# Altium schematic sheet Sheet1.SchDoc
size 420 x 297 mm; SheetTotal: 1
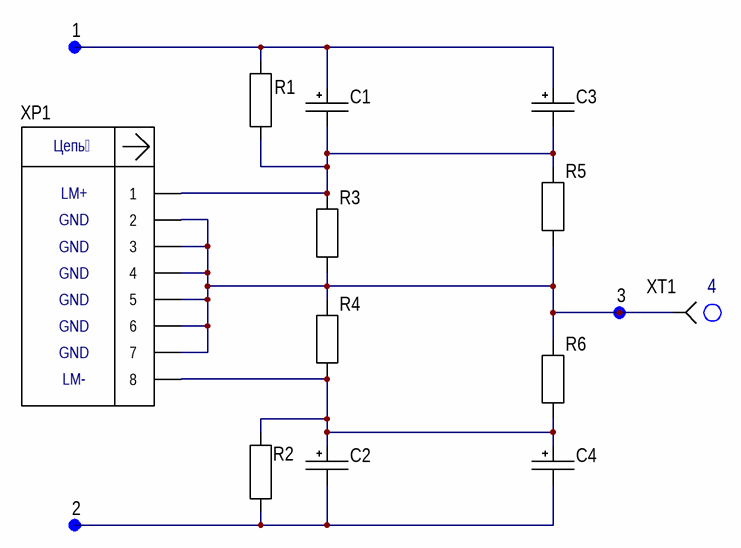
[diagram p0: Sheet1.SchDoc]

## Parts
1  OTV  (value not drawn)
2  OTV  (value not drawn)
3  OTV  (value not drawn)
C1  B43640A2228M000  [B43640A2228M000]  (value not drawn)
C2  B43640A2228M000  [B43640A2228M000]  (value not drawn)
C3  B43640A2228M000  [B43640A2228M000]  (value not drawn)
C4  B43640A2228M000  [B43640A2228M000]  (value not drawn)
R1  С2-33Н-0,5-24 кОм +-5%  [С2-33Н-0,5АИ (070.04.0601.14.00)]  (value not drawn)
R2  С2-33Н-0,5-24 кОм +-5%  [С2-33Н-0,5АИ (070.04.0601.14.00)]  (value not drawn)
R3  OAR3-R005FI  [OAR3]  (value not drawn)
R4  OAR3-R005FI  [OAR3]  (value not drawn)
R5  OAR3-R005FI  [OAR3]  (value not drawn)
R6  OAR3-R005FI  [OAR3]  (value not drawn)
XP1  280373-2  [280373-2]  (value not drawn)
XT1  SOCKET  (value not drawn)

## Nets
Net1_?1: 1.?1 C1.1 C3.1 R1.2
Net2_?1: 2.?1 C2.2 C4.2 R2.1
Net3_?1: 3.?1 R3.1 R4.2 R5.1 R6.2 XP1.2 XP1.3 XP1.4 XP1.5 XP1.6 XP1.7
NetC1_2: C1.2 C3.2 R1.1 R3.2 R5.2 XP1.1
NetC2_1: C2.1 C4.1 R2.2 R4.1 R6.1 XP1.8

## Notes on the sheet
- LM+
- GND
- (near XT1) 4
- LM-
- Перв. примен.
- Справ. №
- Подп. дата
- Инв. № дубл.
- Взам. инв. №
- Подп. и дата
- Изм.
- Разраб.
- Лист
- № докум.
- Подп.
- Дата
- Лит.
- Масса
- Масштаб
- Пров.
- Т.контр.
- Листов
- Инв. № подл.
- Н.контр.
- Утв.
- ALTIUM GOSTBOM2.0 KEV
- Формат А3
- (in symbol 280373-2) Цепь

## Library data of the parts
C1-C4 = B43640A2228M000: Capacitor Polarised, 2200uF, 30x55
R1 R2 = С2-33Н-0,5-24 кОм +-5%: Резисторы постоянные непроволочные общего применения С2-33Н АИ, производитель "АО"НПО"ЭРКОН"; Номинальная мощность рассеяния: 0,5 Вт; Диапазон значений номинальных сопротивлений: от 1 Ом до 5,11 МОм; Ряд сопротивлений: Е24, Е96; Категории качества: «ОТК»; ТУ: ОЖО.467.173 ТУ; Value: 430 Ом
R3-R6 = OAR3-R005FI: ModelPrint: 0402; Value: 0.005 Ом
XP1 = 280373-2: Connector